# Altium schematic sheet WCHA_SCH.SchDoc: Wireless Control Of Home Appliances
size A; Engineer: Muhammad Tayyab; Organization: MT Technologies; Revision: 2.0; SheetNumber: 1; SheetTotal: 1
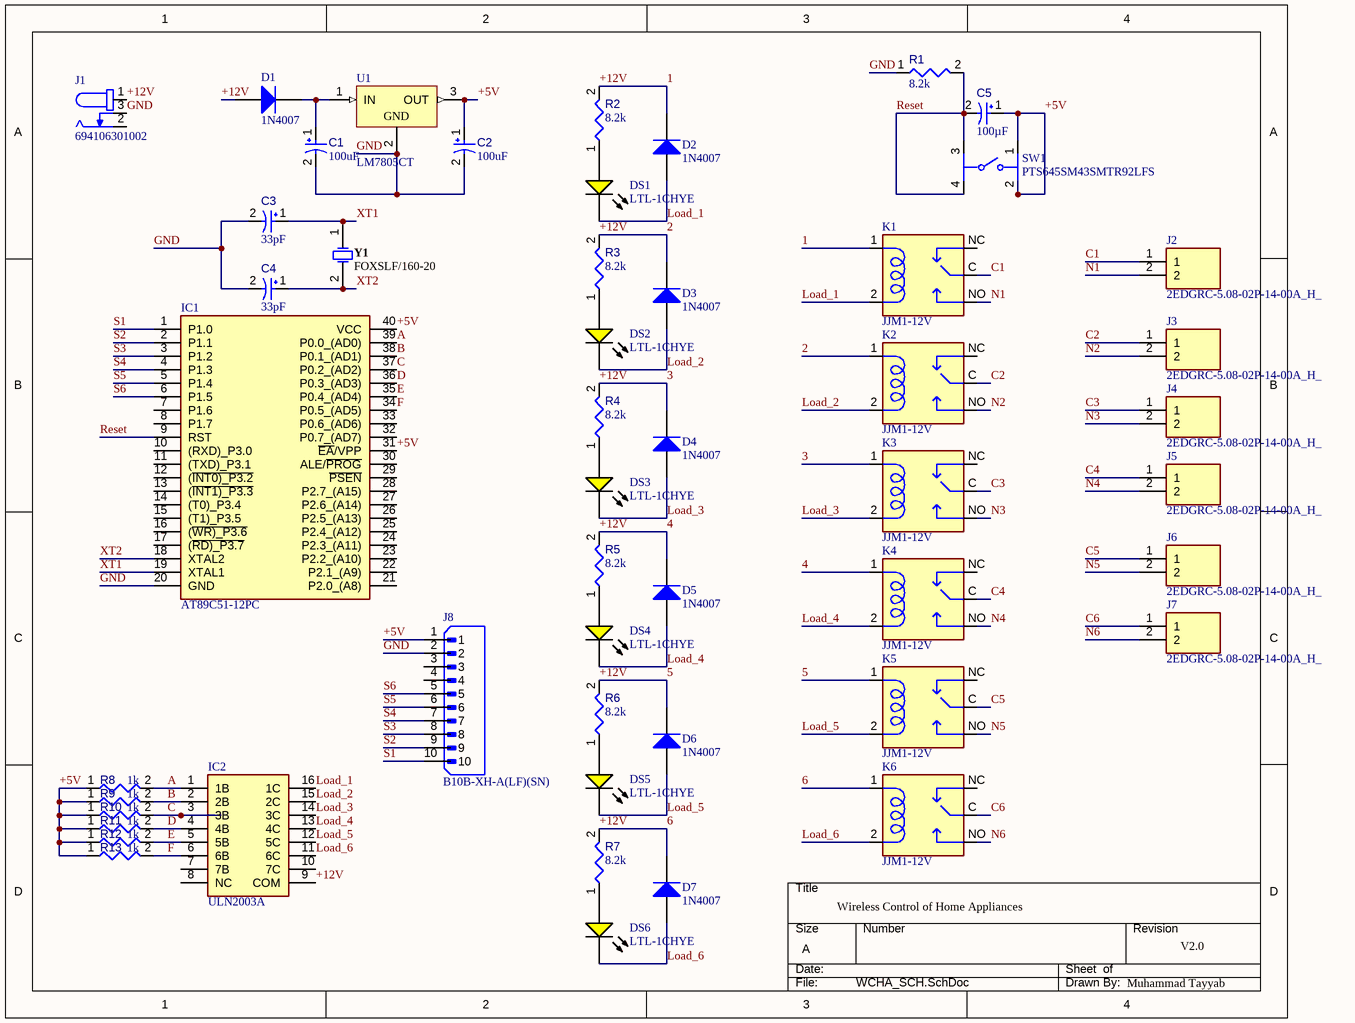
[diagram p0: WCHA_SCH.SchDoc]

## Parts
C1  value 100uF  [CAPPR65-500-2000X1000X2200]  (hidden comment: ECA1EM102)
C2  value 100uF  [CAPPR65-500-2000X1000X2200]  (hidden comment: ECA1EM102)
C3  value 33pF  [CAPPR65-350-1150X800X1250]  (hidden comment: ECA1HM101)
C4  value 33pF  [CAPPR65-350-1150X800X1250]  (hidden comment: ECA1HM101)
C5  value 100µF  [CAPPR65-350-1150X800X1250]  (hidden comment: ECA1HM101)
D1  1N4007  [FAIR-DO-41-2]
D2  1N4007  [FAIR-DO-41-2]
D3  1N4007  [FAIR-DO-41-2]
D4  1N4007  [FAIR-DO-41-2]
D5  1N4007  [FAIR-DO-41-2]
D6  1N4007  [FAIR-DO-41-2]
D7  1N4007  [FAIR-DO-41-2]
DS1  LTL-1CHYE  [LTST-LTL-1CHYE]
DS2  LTL-1CHYE  [LTST-LTL-1CHYE]
DS3  LTL-1CHYE  [LTST-LTL-1CHYE]
DS4  LTL-1CHYE  [LTST-LTL-1CHYE]
DS5  LTL-1CHYE  [LTST-LTL-1CHYE]
DS6  LTL-1CHYE  [LTST-LTL-1CHYE]
IC1  AT89C51-12PC  [DIP1525W56P254L5220H559Q40N]
IC2  ULN2003A  [DIP762W54P254L1918H445Q16N]
J1  694106301002  [694106301002]
J2  2EDGRC-5.08-02P-14-00A_H_  [SHDRRA2W100P0X508_1X2_1156X1210X780P]
J3  2EDGRC-5.08-02P-14-00A_H_  [SHDRRA2W100P0X508_1X2_1156X1210X780P]
J4  2EDGRC-5.08-02P-14-00A_H_  [SHDRRA2W100P0X508_1X2_1156X1210X780P]
J5  2EDGRC-5.08-02P-14-00A_H_  [SHDRRA2W100P0X508_1X2_1156X1210X780P]
J6  2EDGRC-5.08-02P-14-00A_H_  [SHDRRA2W100P0X508_1X2_1156X1210X780P]
J7  2EDGRC-5.08-02P-14-00A_H_  [SHDRRA2W100P0X508_1X2_1156X1210X780P]
J8  B10B-XH-A(LF)(SN)  [JST_B10B-XH-A(LF)(SN)]
K1  JJM1-12V  [RELAY_JJM1-12V]
K2  JJM1-12V  [RELAY_JJM1-12V]
K3  JJM1-12V  [RELAY_JJM1-12V]
K4  JJM1-12V  [RELAY_JJM1-12V]
K5  JJM1-12V  [RELAY_JJM1-12V]
K6  JJM1-12V  [RELAY_JJM1-12V]
R1  value 8.2k  [RESA60-630X240]  (hidden comment: MFR-25FBF52-47K5)
R2  value 8.2k  [RESA60-630X240]  (hidden comment: MFR-25FBF52-47K5)
R3  value 8.2k  [RESA60-630X240]  (hidden comment: MFR-25FBF52-47K5)
R4  value 8.2k  [RESA60-630X240]  (hidden comment: MFR-25FBF52-47K5)
R5  value 8.2k  [RESA60-630X240]  (hidden comment: MFR-25FBF52-47K5)
R6  value 8.2k  [RESA60-630X240]  (hidden comment: MFR-25FBF52-47K5)
R7  value 8.2k  [RESA60-630X240]  (hidden comment: MFR-25FBF52-47K5)
R8  value 1k  [RESA60-630X240]  (hidden comment: MFR-25FBF52-47K5)
R9  value 1k  [RESA60-630X240]  (hidden comment: MFR-25FBF52-47K5)
R10  value 1k  [RESA60-630X240]  (hidden comment: MFR-25FBF52-47K5)
R11  value 1k  [RESA60-630X240]  (hidden comment: MFR-25FBF52-47K5)
R12  value 1k  [RESA60-630X240]  (hidden comment: MFR-25FBF52-47K5)
R13  value 1k  [RESA60-630X240]  (hidden comment: MFR-25FBF52-47K5)
SW1  PTS645SM43SMTR92LFS  [FP-PTS645SM43SMTR92LFS-MFG]
U1  LM7805CT  [FAIR-TO-220-3]
Y1  FOXSLF/160-20  [FOX-FOXSLF160-20]

## Nets
+5V: C2.1 C5.1 IC1.31(~{EA}/VPP) IC1.40(VCC) J8.1 R8.1 R9.1 R10.1 R11.1 R12.1 R13.1 SW1.1 SW1.2 U1.3(OUT)
+12V: D1.2(A) D2.1(K) D3.1(K) D4.1(K) D5.1(K) D6.1(K) D7.1(K) IC2.9(COM) J1.1 K1.1(C1) K2.1(C1) K3.1(C1) K4.1(C1) K5.1(C1) K6.1(C1) R2.2 R3.2 R4.2 R5.2 R6.2 R7.2  [also labelled 1, 2, 3, 4, 5, 6]
A: IC1.39(P0.0_(AD0)) IC2.1(1B) R8.2
B: IC1.38(P0.1_(AD1)) IC2.2(2B) R9.2
C: IC1.37(P0.2_(AD2)) IC2.3(3B) R10.2
C1: J2.1 K1.C(M)
C2: J3.1 K2.C(M)
C3: J4.1 K3.C(M)
C4: J5.1 K4.C(M)
C5: J6.1 K5.C(M)
C6: J7.1 K6.C(M)
D: IC1.36(P0.3_(AD3)) IC2.4(4B) R11.2
E: IC1.35(P0.4_(AD4)) IC2.5(5B) R12.2
F: IC1.34(P0.5_(AD5)) IC2.6(6B) R13.2
GND: C1.2 C2.2 C3.2 C4.2 IC1.20(GND) J1.3 J8.2 R1.1 U1.2(GND)
Load_1: D2.2(A) DS1.2(K) IC2.16(1C) K1.2(C2)
Load_2: D3.2(A) DS2.2(K) IC2.15(2C) K2.2(C2)
Load_3: D4.2(A) DS3.2(K) IC2.14(3C) K3.2(C2)
Load_4: D5.2(A) DS4.2(K) IC2.13(4C) K4.2(C2)
Load_5: D6.2(A) DS5.2(K) IC2.12(5C) K5.2(C2)
Load_6: D7.2(A) DS6.2(K) IC2.11(6C) K6.2(C2)
N1: J2.2 K1.NO
N2: J3.2 K2.NO
N3: J4.2 K3.NO
N4: J5.2 K4.NO
N5: J6.2 K5.NO
N6: J7.2 K6.NO
Reset: C5.2 IC1.9(RST) R1.2 SW1.3 SW1.4
S1: IC1.1(P1.0) J8.10
S2: IC1.2(P1.1) J8.9
S3: IC1.3(P1.2) J8.8
S4: IC1.4(P1.3) J8.7
S5: IC1.5(P1.4) J8.6
S6: IC1.6(P1.5) J8.5
XT1: C3.1 IC1.19(XTAL1) Y1.1
XT2: C4.1 IC1.18(XTAL2) Y1.2
NetC1_1: C1.1 D1.1(K) U1.1(IN)
NetDS1_1: DS1.1(A) R2.1
NetDS2_1: DS2.1(A) R3.1
NetDS3_1: DS3.1(A) R4.1
NetDS4_1: DS4.1(A) R5.1
NetDS5_1: DS5.1(A) R6.1
NetDS6_1: DS6.1(A) R7.1

Not connected (* = marked no-connect by the designer): IC1 7(P1.6) 8(P1.7) 10((RXD)_P3.0) 11((TXD)_P3.1) 12((~{INT0)_P3.2}) 13((~{INT1)_P3.3}) 14((T0)_P3.4) 15((T1)_P3.5) 16((~{WR)_P3.6}) 17((~{RD)_P3.7}) 21(P2.0_(A8)) 22(P2.1_(A9)) 23(P2.2_(A10)) 24(P2.3_(A11)) 25(P2.4_(A12)) 26(P2.5_(A13)) 27(P2.6_(A14)) 28(P2.7_(A15)) 29(~{PSEN}) 30(ALE/~{PROG}) 32(P0.7_(AD7)) 33(P0.6_(AD6)); IC2 7(7B) 8(NC) 10(7C); J1 2; J8 3 4; K1 NC; K2 NC; K3 NC; K4 NC; K5 NC; K6 NC

## Notes on the sheet
- Wireless Control of Home Appliances
- V2.0
- Muhammad Tayyab
- THIS DOCUMENT AND THE DATA DISCLOSED HEREIN OR
- HEREWITH IS THE PROPERTY OF ALTIUM LIMITED AND MAY
- DWG NO:
- REVISION
- REV:
- DESCRIPTION
- DATE
- APPROVED
- BE FREELY DISTRIBUTED IN WHOLE. NO RIGHTS ARE
- RESERVED OR EXPRESS OR IMPLIED WARANTEE GIVEN.
- ENG:
- APPROVALS
- PROJECT
- DSN:
- CHK:
- REFERENCE DOCUMENTS
- PROJECT REVISION:
- TITLE
- DOCUMENT REVISION:
- DESIGN ITEM:
- BOM:
- FAB DWG:
- PCB DWG:
- ASSY DWG:
- SCALE:
- A3
- SIZE
- CAGE CODE
- FILE NAME
- DWG NO.
- SHEET
- OF
- REV

## Library data of the parts
C1 C2 = CMP-001-00023-8: Aluminum Electrolytic Capacitor, 1000 uF, +/- 20%, 25 V, -40 to 85 degC, 2-Pin THD, RoHS, Bulk; Manufacturer: Panasonic; Ripple Current: 850mA; Voltage Rating: 25V; Lead Pitch: 5mm; Datasheet URL: https://industrial.panasonic.com/cdbs/www-data/pdf/RDF0000/ABA0000C1218.pdf; Packaging: Bulk; Package Reference: CAPPR65-500-2000X1000X2200; Package Description: 2-Pin Radial Lead, Dia 10 mm, Height 22 mm; Diameter: 10mm; Min Operating Temperature: -40°C; Datasheet Version: Rev. 05, 10/2016; RoHS Compliant: True; Capacitor Type: Electrolytic; Tolerance: 20%; Mounting Technology: TH; Manufacturer URL: http://www.panasonic.com/; Max Operating Temperature: 85°C; Package Quantity: 200; Case/Package: Radial
C3-C5 = CMP-001-00026-7: Aluminum Electrolytic Capacitor, 100 uF, +/- 20%, 50 V, -40 to 85 degC, 2-Pin THD, RoHS, Bulk; Manufacturer: Panasonic; Voltage Rating: 50V; Ripple Current: 250mA; Datasheet URL: https://industrial.panasonic.com/cdbs/www-data/pdf/RDF0000/ABA0000C1218.pdf; Lead Pitch: 3.5mm; Mounting Technology: TH; Package Description: 2-Pin Radial Lead, Dia 8 mm, Height 12.5 mm; Diameter: 8mm; Ripple Current (AC): 250mA; Manufacturer URL: http://www.panasonic.com/; Capacitor Type: Electrolytic; Max Operating Temperature: 85°C; Pins: 2; Min Operating Temperature: -40°C; Tolerance: 20%; Case/Package: Radial; Packaging: Bulk; Package Quantity: 200; Package Reference: CAPPR65-350-1150X800X1250; RoHS Compliant: True; Datasheet Version: Rev. 05, 10/2016
D1-D7 = CMP-004-00007-2: General Purpose Rectifier, 1.1 V, 1.0 A, -55 to 175 degC, 2-Pin DO-41, RoHS, Tape and Reel; Manufacturer: Fairchild; Peak Reverse Current: 5uA; Max Surge Current: 30A; Elements: 1; Forward Voltage: 1.1V; Package Version: Rev. 2, 09/2008; Forward Current: 1A; Package Quantity: 5000; Packaging: TapeandReel; Package URL: http://www.fairchildsemi.com/dwg/DO/DO41A.pdf; Manufacturer URL: https://www.fairchildsemi.com/; Package Reference: DO-41-2; Pins: 2; Min Operating Temperature: -55°C; Datasheet Version: Rev. 1.1.0, 11/2014; Max Operating Temperature: 175°C; RoHS Compliant: True; Case/Package: DO-41-2; Mounting Technology: TH; Package Description: 2-Pin Axial Lead, Dia 2.375 mm, Body Length 4.63 mm; Datasheet URL: https://www.fairchildsemi.com/datasheets/1N/1N4007.pdf
DS1-DS6 = CMP-007-00020-2: LED Uni-Color Yellow, 60 mW, 20 mA, -55 to 100 degC, 2-Pin THD, RoHS, Bulk; Manufacturer: Lite-On; Nominal Vf: 2.1V; Luminous Intensity: 40mcd; Lens Style: Dome; Forward Current: 20mA; Viewing Angle: 45degrees; Max Operating Temperature: 100°C; Case/Package: Radial; Min Operating Temperature: -55°C; Colour: Yellow; Datasheet Version: Rev. B, 07/2013; Packaging: Bulk; Illumination Colour: Yellow; Package Quantity: 1000; Pins: 2; Package Reference: LTL-1CHYE; Forward Voltage: 2.1V; Mounting Technology: TH; Datasheet URL: https://datasheet.ciiva.com/4269/s-110-ltl-1chye-4269126.pdf; RoHS Compliant: True; Package Description: 2-Pin Through Hole Device, Dia 3.8 mm, Pitch 2.54 mm; Manufacturer URL: http://www.us.liteon.com/
IC1 = AT89C51-12PC: Integrated Circuit; Manufacturer_Name: Microchip; Datasheet Link: http://ww1.microchip.com/downloads/en/devicedoc/doc0265.pdf; Height: 5.59mm; Manufacturer_Part_Number: AT89C51-12PC; Mouser Part Number: 556-AT89C51-12PC; Mouser Price/Stock: https://www.mouser.co.uk/ProductDetail/Microchip-Technology/AT89C51-12PC?qs=fKsNvYl5pt%252B5M7MsETpzQw%3D%3D
IC2 = ULN2003A: Integrated Circuit; Manufacturer_Name: UMW; Datasheet Link: https://media.digikey.com/pdf/Data%20Sheets/UTD%20Semi%20PDFs/ULN2003.pdf; Height: 4.45mm; Manufacturer_Part_Number: ULN2003A
J1 = 694106301002: <b> WR-DC DC Power Jack Right Angled (6.4) <br> <br> KIND PROPERTIES  <br><br> </b>Quality Class 5 000 Mating cycles  <br>Type Right Angled  <br> <br> <b>MATERIAL PROPERTIES  <br><br> </b>Insulator Material PA66  <br>Insulator Flammability Rating UL94 V-0  <br>Color Black  <br>Contact Material Copper Alloy  <br>Contact Type Stamped  <br>Center Pin Plating Gold  <br>Center Pin Terminal Plating Tin  <br>Tip Spring Material Tin  <br>Shunt Terminal Plating Tin  <br><br> <b>GENERAL INFORMATION  <br><br> </b>Operating Temperature -40 up to +85 Â°C  <br>Compliance RoHS  <br> <br> <b>ELECTRICAL PROPERTIES  <br><br> </b>IR 1 5 A  <br>Working Voltage 30 V (AC)  <br>Withstanding Voltage 500 V (AC)  <br>Contact Resistance 50 mÎ©  <br>RISO 100 MÎ©  <br> <br> <b>PACKAGING PROPERTIES  <br><br> </b>Packaging Bag  <br> <br> <br><a href="https://www.we-online.com/catalog/media/o59009v209%20Family_WR-DC_DC_Power_Jack_Right_Angled_THT_69410x301002.jpg" title="Enlarge picture"> <img src="https://www.we-online.com/catalog/media/o59009v209%20Family_WR-DC_DC_Power_Jack_Right_Angled_THT_69410x301002.jpg" width="320"></a><p> Details see: <a href="https://www.we-online.com/catalog/en/DC_RIGHT_ANGLED_6_4_69410X301002">https://www.we-online.com/catalog/en/DC_RIGHT_ANGLED_6_4_69410X301002</a><p> </b>Updated by Ella Wu  2021-09-30<br> </b>2021(C) Wurth Elektronik; MF: {'manufacturer': u'Wurth Elektronik'}; Package: None; Price: None; Value: *; MP: 694106301002; Availability: Unavailable
J2-J7 = CMP-002-00074-1: R/A SHrouded Header; Manufacturer_Name: Degson; Manufacturer_Part_Number: 2EDGRC-5.08-02P-14-00A(H); Geometry.Height: 7.8mm; Mouser Part Number: *; Arrow Price/Stock: *; Datasheet Link: *; Mouser Price/Stock: *; Source: 2EDGRC-5.08-02P-14-00A_H_.SchLib; Arrow Part Number: *; Design Item ID: 2EDGRC-5.08-02P-14-00A_H_
J8 = B10B-XH-A(LF)(SN): MF: {'manufacturer': u'JST Sales'}; Package: None; Price: None; Value: *; MP: B10B-XH-A(LF)(SN); Availability: Unavailable
K1-K6 = JJM1-12V: Electromechanical Relay 12VDC 225Ohm 20(NO)/10(NC)A SPDT (( 15.5mm 12mm 13.9mm)) THT Automotive Relay; MF: {'manufacturer': u'Panasonic Electric'}; Package: None; Price: None; Value: *; MP: JJM1-12V; Availability: Unavailable
R1-R13 = CMP-009-00057-4: Axial Resistor, 47.5 KOhm, +/- 1%, 0.25 W, -55 to 155 degC, 2-Pin THD, RoHS, Bulk; Manufacturer: Yageo; Voltage Rating: 250V; Power: 250mW; RoHS Compliant: True; Packaging: Bulk; Manufacturer URL: http://www.yageo.com/; Package Quantity: 200; Datasheet URL: http://www.yageo.com/documents/recent/Yageo%20LR_MFR_2013.pdf; Case/Package: Axial; Package Reference: MFR-25; Tolerance: 1%; Max Operating Temperature: 155°C; Package Description: 2-Pin Axial Lead, Dia 2.4 mm, Body Length 6.3 mm; Datasheet Version: Apr-13; Min Operating Temperature: -55°C; Mounting Technology: TH
SW1 = CMP-2000-05160-2: SWITCH TACTILE SPST-NO 0.05A 12V; Contact Resistance: 100mR; Throw Configuration: SPST; Illumination Type: Non-Illuminated; Mechanical Life: 100000Cycles; Current Rating: 50mA; Switch Function: Off-Mom; Actuator Length: 0.85mm; Actuator Material: Nylon; Actuator Type: Standard; Operating Force: 160gf; Min Operating Temperature: -20°C; REACH SVHC: No SVHC; Termination: Gull Wing; Case/Package: SMD/SMT; Packaging: Tape and Reel; Mount: Surface Mount; Voltage Rating (DC): 12V; Orientation: Straight; Lead Free: Lead Free; Contact Material: Silver; Color: Black; Max Current Rating: 50mA; Contact Plating: Silver; Depth: 9mm; Package Quantity: 1; Max Voltage Rating (DC): 12V; Length: 6mm; Max Operating Temperature: 60°C
U1 = CMP-2000-04938-1: Positive Voltage Regulator, 5 V, 1 A, -40 to 125 degC, 3-Pin TO-220, RoHS, Tube; Manufacturer: FairchildSemiconductor; Maximum Input Voltage: 35V; Maximum Quiescent Current: 8mA; Load Regulation: 100mV; Maximum Output Current: 2.2(Typ)A; Output Type: Fixed; Typical Dropout Voltage @ Current: 2@1AV; Rad Hard: No; Output Voltage: 5V; Accuracy: ±4%; Number of Outputs: 1; Category: LinearRegulator; Package Description: 3-Pin Through Hole Device, Body 10 x 4.5 mm, Pitch 2.54 mm; Packaging: Rail/Tube; Mounting: ThroughHole; Polarity: Positive; Manufacturer URL: https://www.fairchildsemi.com/; Line Regulation: 100mV; Datasheet Version: Aug-12; Datasheet URL: https://datasheet.ciiva.com/26904/lm7805ct-26904988.pdf; Package Reference: TO-220; Package URL: https://www.fairchildsemi.com/package-drawings/TO/TO220B03.pdf; Package: 3TO-220AB; Operating Temperature: -40to125degC; Type: Linear
Y1 = CMP-003-00027-2: Resistance Weld Thru-Hole Crystal, 16 MHz, +/- 30 ppm, 20 pF, -20 to 70 degC, 2-Pin THD, RoHS, Bulk; Manufacturer: FOX Electronics; Load Capacitance: 20pF; Resistance: 40Ohm; ESR: 40; Tolerance: 50ppm; Frequency Tolerance: 30ppm; Frequency: 16MHz; Datasheet URL: http://www.foxonline.com/pdfs/hc49slf.pdf; Packaging: Bulk; Min Operating Temperature: -20°C; Max Operating Temperature: 70°C; Mounting Technology: TH; RoHS Compliant: True; Datasheet Version: Mar-15; Manufacturer URL: http://www.foxonline.com/; Package Description: 2-Pin Through Hole Device, Body 11.35 x 4.65 mm; Pins: 2; Package Quantity: 100; Case/Package: FOXSLF160-20; Package Reference: FOXSLF160-20